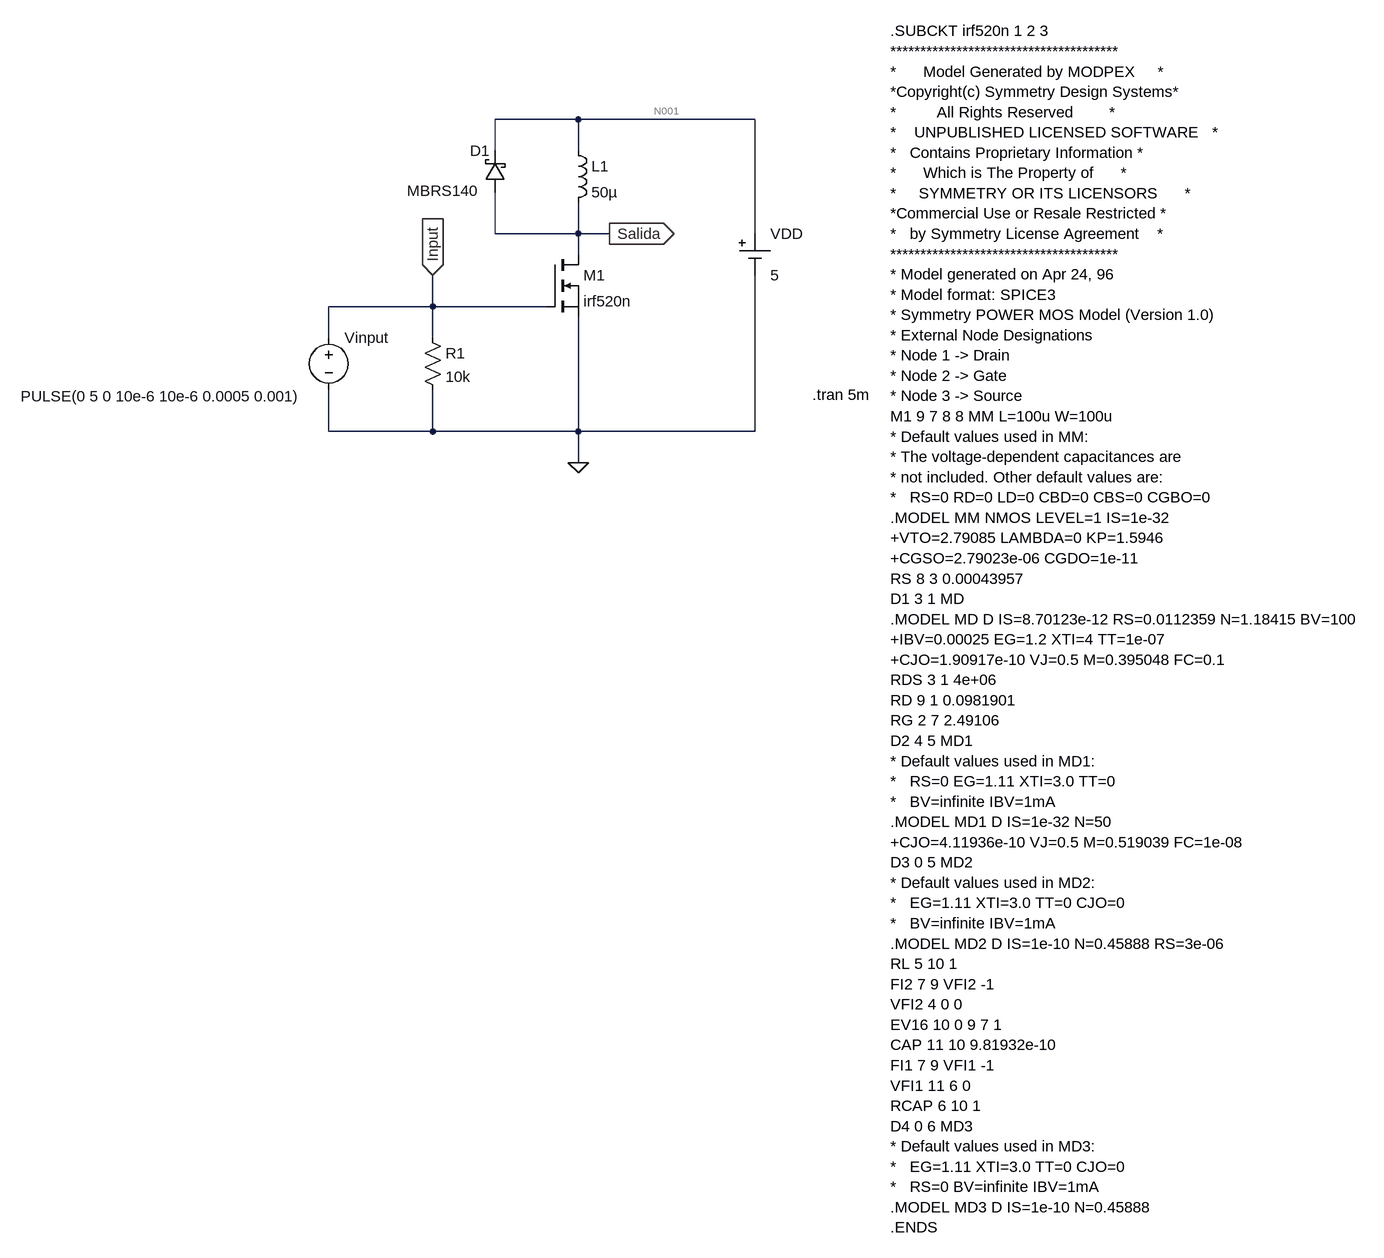
[diagram p0: schematic Circuito del ejercicio 9.asc]
Circuito del ejercicio 9.asc, the LTspice schematic file:
Version 4
SHEET 1 1340 1484
WIRE 80 -48 -48 -48
WIRE 352 -48 80 -48
WIRE -48 0 -48 -48
WIRE 80 0 80 -48
WIRE -48 128 -48 64
WIRE 80 128 80 80
WIRE 80 128 -48 128
WIRE 128 128 80 128
WIRE 352 128 352 -48
WIRE 80 160 80 128
WIRE -144 240 -144 192
WIRE -144 240 -304 240
WIRE 32 240 -144 240
WIRE -304 288 -304 240
WIRE -144 288 -144 240
WIRE -304 432 -304 368
WIRE -144 432 -144 368
WIRE -144 432 -304 432
WIRE 80 432 80 256
WIRE 80 432 -144 432
WIRE 352 432 352 192
WIRE 352 432 80 432
WIRE 80 480 80 432
FLAG 128 128 Salida
IOPIN 128 128 Out
FLAG -144 192 Input
IOPIN -144 192 In
FLAG 80 480 0
SYMBOL Misc\\cell 352 128 R0
WINDOW 123 0 0 Left 0
WINDOW 39 0 0 Left 0
SYMATTR InstName VDD
SYMATTR Value 5
SYMBOL res -160 272 R0
SYMATTR InstName R1
SYMATTR Value 10k
SYMBOL nmos 32 160 R0
SYMATTR InstName M1
SYMATTR Value irf520n
SYMATTR Prefix X
SYMBOL voltage -304 272 R0
WINDOW 3 -474 106 Left 2
WINDOW 123 0 0 Left 0
WINDOW 39 0 0 Left 0
SYMATTR InstName Vinput
SYMATTR Value PULSE(0 5 0 10e-6 10e-6 0.0005 0.001)
SYMBOL schottky -32 64 R180
WINDOW 0 24 64 Left 2
WINDOW 3 42 2 Left 2
SYMATTR InstName D1
SYMATTR Value MBRS140
SYMATTR Description Diode
SYMATTR Type diode
SYMBOL ind 64 -16 R0
SYMATTR InstName L1
SYMATTR Value 50µ
SYMATTR SpiceLine Rser=7.49
TEXT 440 376 Left 2 !.tran 5m
TEXT 560 -184 Left 2 !.SUBCKT irf520n 1 2 3\n**************************************\n*      Model Generated by MODPEX     *\n*Copyright(c) Symmetry Design Systems*\n*         All Rights Reserved        *\n*    UNPUBLISHED LICENSED SOFTWARE   *\n*   Contains Proprietary Information *\n*      Which is The Property of      *\n*     SYMMETRY OR ITS LICENSORS      *\n*Commercial Use or Resale Restricted *\n*   by Symmetry License Agreement    *\n**************************************\n* Model generated on Apr 24, 96\n* Model format: SPICE3\n* Symmetry POWER MOS Model (Version 1.0)\n* External Node Designations\n* Node 1 -> Drain\n* Node 2 -> Gate\n* Node 3 -> Source\nM1 9 7 8 8 MM L=100u W=100u\n* Default values used in MM:\n* The voltage-dependent capacitances are\n* not included. Other default values are:\n*   RS=0 RD=0 LD=0 CBD=0 CBS=0 CGBO=0\n.MODEL MM NMOS LEVEL=1 IS=1e-32\n+VTO=2.79085 LAMBDA=0 KP=1.5946\n+CGSO=2.79023e-06 CGDO=1e-11\nRS 8 3 0.00043957\nD1 3 1 MD\n.MODEL MD D IS=8.70123e-12 RS=0.0112359 N=1.18415 BV=100\n+IBV=0.00025 EG=1.2 XTI=4 TT=1e-07\n+CJO=1.90917e-10 VJ=0.5 M=0.395048 FC=0.1\nRDS 3 1 4e+06\nRD 9 1 0.0981901\nRG 2 7 2.49106\nD2 4 5 MD1\n* Default values used in MD1:\n*   RS=0 EG=1.11 XTI=3.0 TT=0\n*   BV=infinite IBV=1mA\n.MODEL MD1 D IS=1e-32 N=50\n+CJO=4.11936e-10 VJ=0.5 M=0.519039 FC=1e-08\nD3 0 5 MD2\n* Default values used in MD2:\n*   EG=1.11 XTI=3.0 TT=0 CJO=0\n*   BV=infinite IBV=1mA\n.MODEL MD2 D IS=1e-10 N=0.45888 RS=3e-06\nRL 5 10 1\nFI2 7 9 VFI2 -1\nVFI2 4 0 0\nEV16 10 0 9 7 1\nCAP 11 10 9.81932e-10\nFI1 7 9 VFI1 -1\nVFI1 11 6 0\nRCAP 6 10 1\nD4 0 6 MD3\n* Default values used in MD3:\n*   EG=1.11 XTI=3.0 TT=0 CJO=0\n*   RS=0 BV=infinite IBV=1mA\n.MODEL MD3 D IS=1e-10 N=0.45888\n.ENDS

The netlist it stands for:
* Circuito del ejercicio 9.asc
VDD N001 0 5
R1 Input 0 10k
XM1 Salida Input 0 irf520n  ; pins D G S
Vinput Input 0 PULSE(0 5 0 10e-6 10e-6 0.0005 0.001)
D1 Salida N001 MBRS140
L1 N001 Salida 50µ Rser=7.49
.model D D
.lib standard.dio
.tran 5m
.SUBCKT irf520n 1 2 3
**************************************
*      Model Generated by MODPEX     *
*Copyright(c) Symmetry Design Systems*
*         All Rights Reserved        *
*    UNPUBLISHED LICENSED SOFTWARE   *
*   Contains Proprietary Information *
*      Which is The Property of      *
*     SYMMETRY OR ITS LICENSORS      *
*Commercial Use or Resale Restricted *
*   by Symmetry License Agreement    *
**************************************
* Model generated on Apr 24, 96
* Model format: SPICE3
* Symmetry POWER MOS Model (Version 1.0)
* External Node Designations
* Node 1 -> Drain
* Node 2 -> Gate
* Node 3 -> Source
M1 9 7 8 8 MM L=100u W=100u
* Default values used in MM:
* The voltage-dependent capacitances are
* not included. Other default values are:
*   RS=0 RD=0 LD=0 CBD=0 CBS=0 CGBO=0
.MODEL MM NMOS LEVEL=1 IS=1e-32
+VTO=2.79085 LAMBDA=0 KP=1.5946
+CGSO=2.79023e-06 CGDO=1e-11
RS 8 3 0.00043957
D1 3 1 MD
.MODEL MD D IS=8.70123e-12 RS=0.0112359 N=1.18415 BV=100
+IBV=0.00025 EG=1.2 XTI=4 TT=1e-07
+CJO=1.90917e-10 VJ=0.5 M=0.395048 FC=0.1
RDS 3 1 4e+06
RD 9 1 0.0981901
RG 2 7 2.49106
D2 4 5 MD1
* Default values used in MD1:
*   RS=0 EG=1.11 XTI=3.0 TT=0
*   BV=infinite IBV=1mA
.MODEL MD1 D IS=1e-32 N=50
+CJO=4.11936e-10 VJ=0.5 M=0.519039 FC=1e-08
D3 0 5 MD2
* Default values used in MD2:
*   EG=1.11 XTI=3.0 TT=0 CJO=0
*   BV=infinite IBV=1mA
.MODEL MD2 D IS=1e-10 N=0.45888 RS=3e-06
RL 5 10 1
FI2 7 9 VFI2 -1
VFI2 4 0 0
EV16 10 0 9 7 1
CAP 11 10 9.81932e-10
FI1 7 9 VFI1 -1
VFI1 11 6 0
RCAP 6 10 1
D4 0 6 MD3
* Default values used in MD3:
*   EG=1.11 XTI=3.0 TT=0 CJO=0
*   RS=0 BV=infinite IBV=1mA
.MODEL MD3 D IS=1e-10 N=0.45888
.ENDS
.backanno
.end

* Results of the author's LTspice run, read from the files saved beside the schematic
* Operating Point, zero values left out:
*   V(n001) = 5 V
*   V(salida) = 5 V
*   I(D1) = -109.6 pA
*   I(L1) = 1.25 µA
*   I(Vdd) = -1.25 µA
*   I(Vinput) = 5 pA
*   Ix(m1:1) = 1.25 µA
*   Ix(m1:2) = -5 pA
*   Ix(m1:3) = -1.25 µA
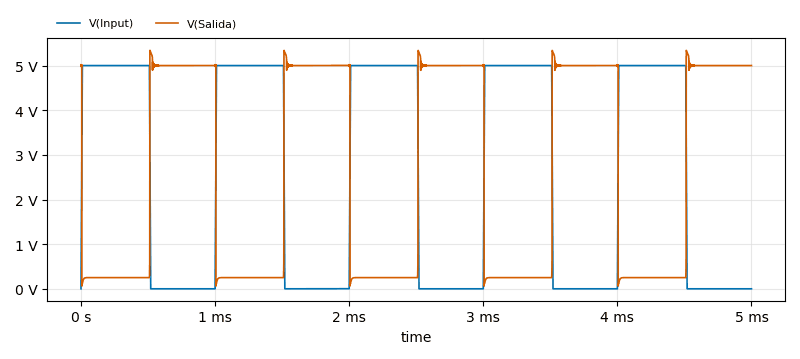
[diagram p1: Transient Analysis of Circuito del ejercicio 9.asc, plotted from the saved traces]
* Transient Analysis, 1 run:
*   V(Input): min 0 V, max 5 V, average 2.55 V, rms 3.559 V, last 0 V
*   V(Salida): min 61.51 mV, max 5.34 V, average 2.597 V, rms 3.523 V, last 5 V